# EAGLE design 2KbeaconDetectorV1.0 (EAGLE 9.6.2)
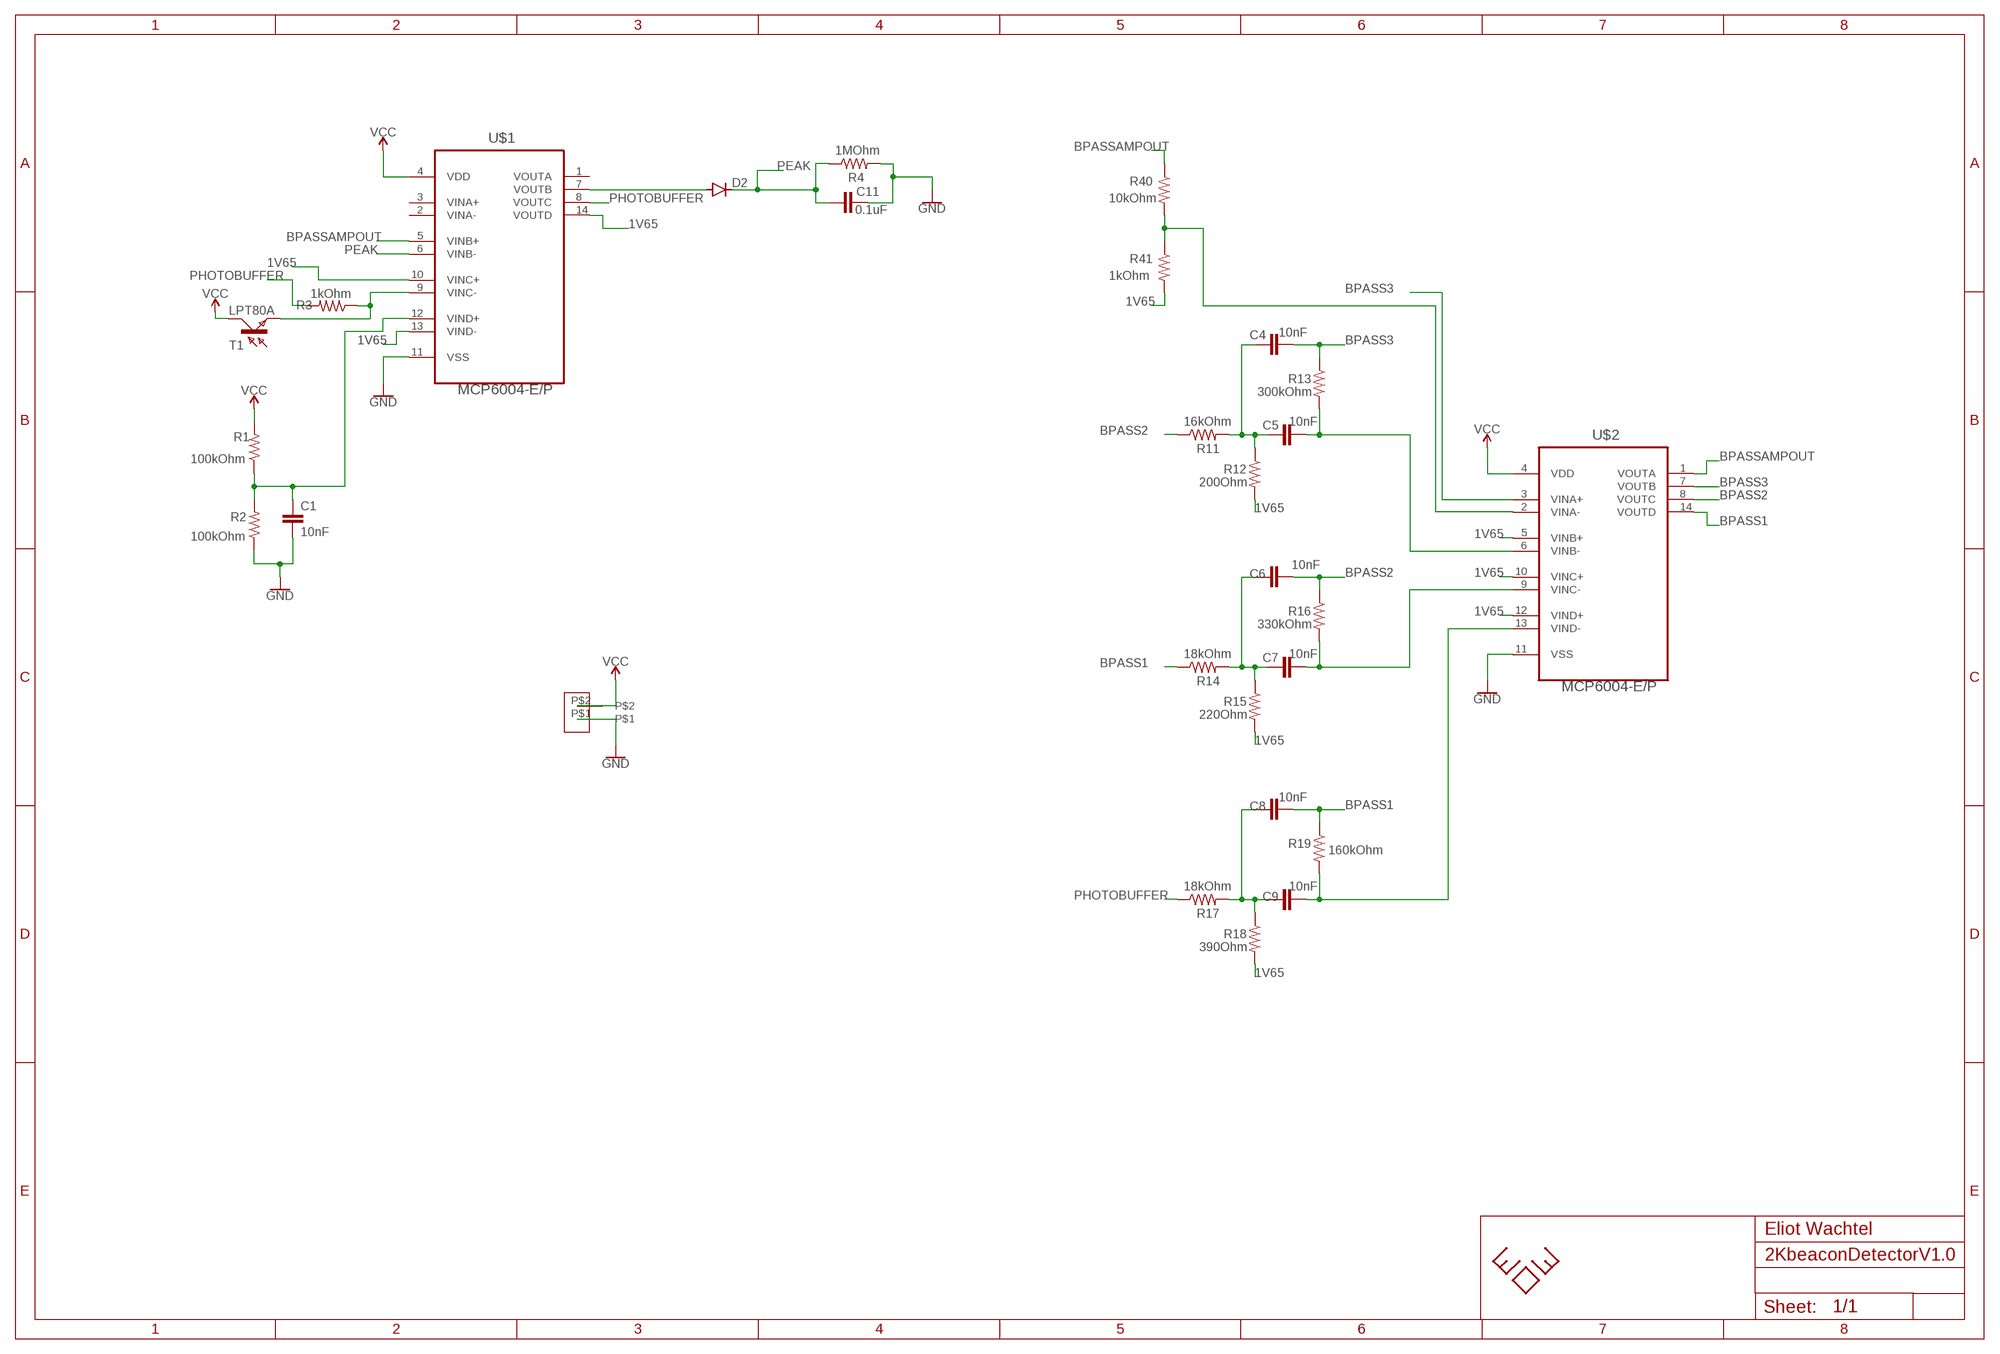
[diagram p0: schematic, sheet 1]

## Parts
C1  10nF  C5/2.5  [C5B2.5]
C4  10nF  C5/2.5  [C5B2.5]
C5  10nF  C5/2.5  [C5B2.5]
C6  10nF  C5/2.5  [C5B2.5]
C7  10nF  C5/2.5  [C5B2.5]
C8  10nF  C5/2.5  [C5B2.5]
C9  10nF  C5/2.5  [C5B2.5]
C11  0.1uF  C5/2.5  [C5B2.5]
D2  DIODE-D-7.5  [D-7.5]
R1  100kOhm  R-US_0207/5V  [0207/5V]
R2  100kOhm  R-US_0207/5V  [0207/5V]
R3  1kOhm  R-US_0204/2V  [0204V]
R4  1MOhm  R-US_0204/5  [0204/5]
R11  16kOhm  R-US_0204/2V  [0204V]
R12  200Ohm  R-US_0204/7  [0204/7]
R13  300kOhm  R-US_0204/2V  [0204V]
R14  18kOhm  R-US_0204/2V  [0204V]
R15  220Ohm  R-US_0204/7  [0204/7]
R16  330kOhm  R-US_0204/2V  [0204V]
R17  18kOhm  R-US_0204/2V  [0204V]
R18  390Ohm  R-US_0204/7  [0204/7]
R19  160kOhm  R-US_0204/2V  [0204V]
R40  10kOhm  R-US_0204/7  [0204/7]
R41  1kOhm  R-US_0204/7  [0204/7]
T1  LPT80A  [LPT80A]
U$1  MCP6004-E/P  [DIP254P762X533-14]
U$2  MCP6004-E/P  [DIP254P762X533-14]
U$4  WIRECONNECT2PIN  [WIRECONNECT2PIN]

## Nets
1V65: R12.2 R15.2 R18.2 R41.2 U$1.10(VINC+) U$1.13(VIND-) U$1.14(VOUTD) U$2.5(VINB+) U$2.10(VINC+) U$2.12(VIND+)
BPASS1: C8.2 R14.1 R19.1 U$2.14(VOUTD)
BPASS2: C6.2 R11.1 R16.1 U$2.8(VOUTC)
BPASS3: C4.2 R13.1 U$2.3(VINA+) U$2.7(VOUTB)
BPASSAMPOUT: R40.1 U$1.5(VINB+) U$2.1(VOUTA)
GND: C1.2 C11.2 R2.1 R4.2 U$1.11(VSS) U$2.11(VSS) U$4.P$1
N$1: C1.1 R1.1 R2.2 U$1.12(VIND+)
N$2: D2.A U$1.7(VOUTB)
N$5: R3.1 T1.E U$1.9(VINC-)
N$8: C4.1 C5.1 R11.2 R12.1
N$9: C7.2 R16.2 U$2.9(VINC-)
N$10: C6.1 C7.1 R14.2 R15.1
N$11: C9.2 R19.2 U$2.13(VIND-)
N$12: C8.1 C9.1 R17.2 R18.1
N$13: C5.2 R13.2 U$2.6(VINB-)
N$25: R40.2 R41.1 U$2.2(VINA-)
PEAK: C11.1 D2.C R4.1 U$1.6(VINB-)
PHOTOBUFFER: R3.2 R17.1 U$1.8(VOUTC)
VCC: R1.2 T1.C U$1.4(VDD) U$2.4(VDD) U$4.P$2
Unconnected: U$1.1(VOUTA) U$1.2(VINA-) U$1.3(VINA+)

## Notes on the sheet
- Eliot Wachtel

## Library data of the parts
C1 C4-C9 C11 = capacitor-wima:C: CAPACITOR naming: grid - package width
D2 = diode:DIODE-: DIODE
R1-R4 R11-R19 R40 R41 = adafruit:R-US_: RESISTOR, American symbol
T1 = opto-trans-siemens:LPT80A: PHOTO TRANSISTOR; OC_FARNELL: unknown; OC_NEWARK: unknown
U$1 U$2 = MCP6004-E_P:MCP6004-E/P: 1 MHz, Low-Power Op Amp; DESCRIPTION: Op Amp Quad Low Power Amplifier R-R I/O 6V Automotive 14-Pin PDIP Tube; DIGI-KEY_PART_NUMBER: MCP6004-E/P-ND; MF: Microchip Technology; MP: MCP6004-E/P; PACKAGE: DIP-14 Microchip; PURCHASE-URL: https://pricing.snapeda.com/search/part/MCP6004-E/P/?ref=eda
U$4 = connectors:WIRECONNECT2PIN

## Board
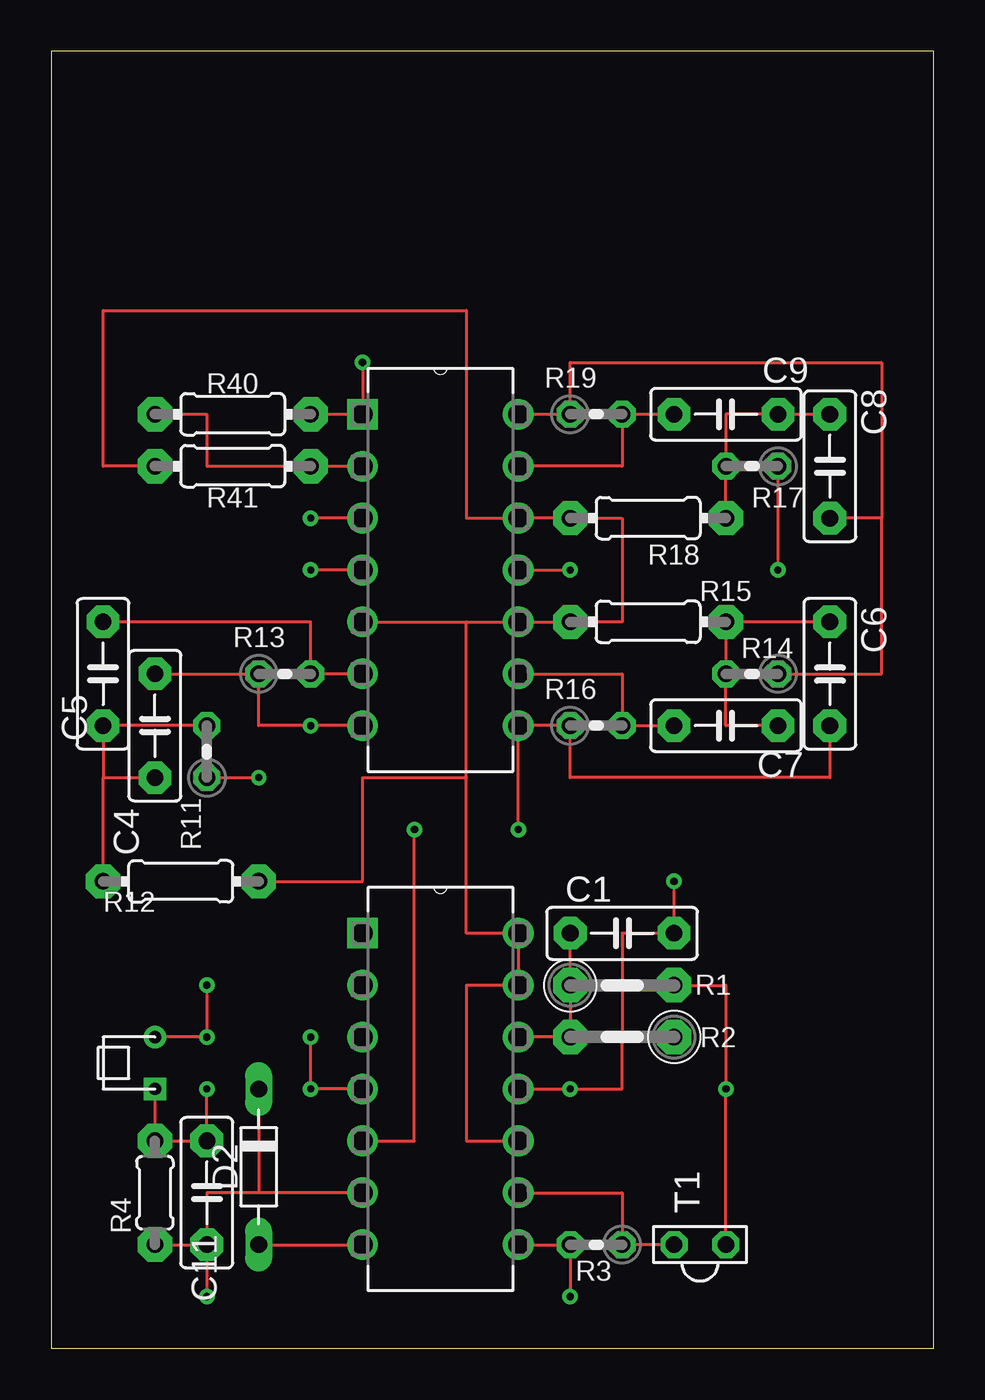
[diagram p1: board, top side]
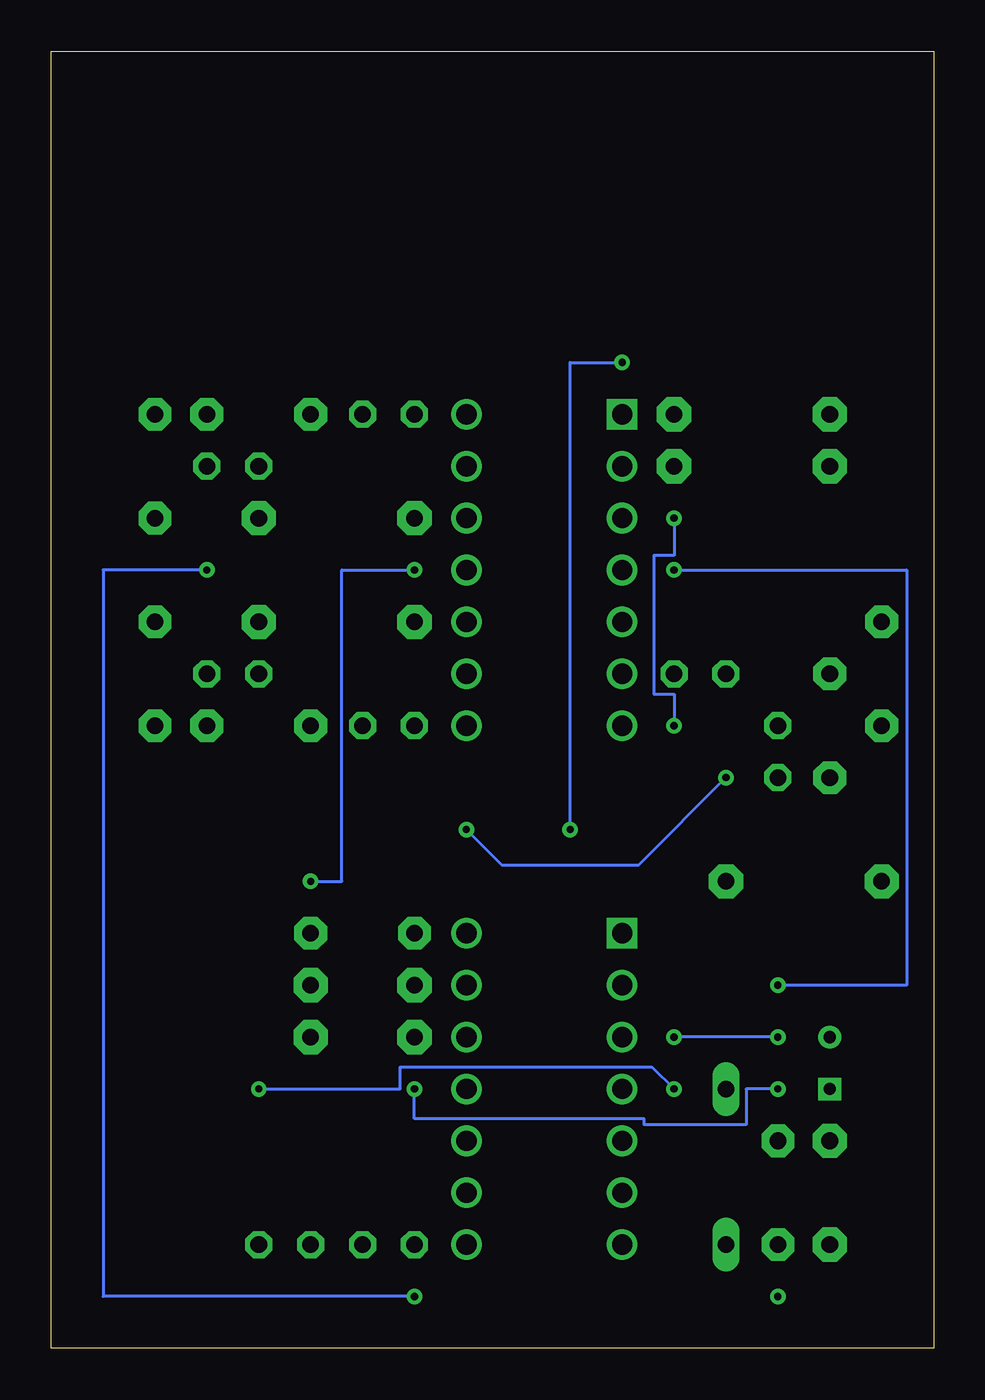
[diagram p2: board, bottom side, seen from below]

Size 43.18 x 63.5 mm. Coordinates in mm from the lower left corner, seen from the top.
Outline: 0,0 43.18,0 43.18,63.5 0,63.5 0,0
Copper layers (1*16): Top 0.035mm / dielectric 1.5mm / Bottom 0.035mm
Design rules "default": minimum track width 6mil, minimum drill 0.35mm, track to track 6mil, track to pad 6mil, pad to pad 6mil, via to via 6mil, smd to smd 6mil, copper to edge 40mil, drill to drill 6mil, minimum pad ring 10mil, minimum via ring 8mil, stop-mask expansion 4mil, vias tented up to drill 0mil, thermal gap 10mil

### Footprints (pad centres in the part's own frame; a part is rotated, then mirrored left to right if it is on the bottom)
C5B2.5 = drill 0.813 pad 1.6 octagon: 1 -2.54,0; 2 2.54,0
D-7.5 = drill 0.813 long: A 3.81,0; C -3.81,0
0207/5V = drill 0.813 pad 1.676 octagon: 1 -2.54,0; 2 2.54,0
0204V = drill 0.813 octagon: 1 -1.27,0; 2 1.27,0
0204/5 = drill 0.813 pad 1.676 octagon: 1 -2.54,0; 2 2.54,0
0204/7 = drill 0.813 pad 1.676 octagon: 1 -3.81,0; 2 3.81,0
LPT80A = drill 0.813 octagon: C 0,-1.27; E 0,1.27
DIP254P762X533-14 = drill 0.991 square: 1 -7.62,15.24 | drill 0.991: 2 -7.62,12.7; 3 -7.62,10.16; 4 -7.62,7.62; 5 -7.62,5.08; 6 -7.62,2.54; 7 -7.62,0; 8 0,0; 9 0,2.54; 10 0,5.08; 11 0,7.62; 12 0,10.16; 13 0,12.7; 14 0,15.24
WIRECONNECT2PIN = drill 0.6 square: P$1 2.54,0 | drill 0.6: P$2 2.54,2.54

### Placement (x,y rotation side)
C1  27.94,20.32 0 top
C4  5.08,30.48 90 top
C5  2.54,33.02 90 top
C6  38.1,33.02 270 top
C7  33.02,30.48 180 top
C8  38.1,43.18 270 top
C9  33.02,45.72 180 top
C11  7.62,7.62 90 top
D2  10.16,8.89 270 top
R1  27.94,17.78 0 top
R2  27.94,15.24 180 top
R3  26.67,5.08 180 top
R4  5.08,7.62 90 top
R11  7.62,29.21 90 top
R12  6.35,22.86 0 top
R13  11.43,33.02 0 top
R14  34.29,33.02 180 top
R15  29.21,35.56 180 top
R16  26.67,30.48 0 top
R17  34.29,43.18 180 top
R18  29.21,40.64 180 top
R19  26.67,45.72 0 top
R40  8.89,45.72 180 top
R41  8.89,43.18 180 top
T1  31.75,5.08 90 top
U$1  22.86,5.08 0 top
U$2  22.86,30.48 0 top
U$4  2.54,12.7 0 top

### Tracks (layer width: path | path; a pad name or v marks a point on that pad's centre or on a via)
1V65
  Top 0.152: U$2.5 20.32,35.56 | 20.32,35.56 U$2.10 R15.2 27.94,35.56 27.94,40.64 R18.2 U$2.12 20.32,40.64 20.32,50.8 2.54,50.8 2.54,43.18 R41.2 | U$1.10 20.32,10.16 20.32,17.78 U$1.13 U$1.14 20.32,20.32 20.32,27.94 | 20.32,27.94 20.32,35.56 | R12.2 15.24,22.86 15.24,27.94 20.32,27.94
BPASS1
  Top 0.152: U$2.14 R19.1 25.4,48.26 40.64,48.26 40.64,40.64 | R14.1 40.64,33.02 40.64,40.64 | 40.64,40.64 C8.2
BPASS2  (via drill 0.35)
  Top 0.152: C6.2 38.1,27.94 25.4,27.94 R16.1 U$2.8 v22.86,25.4 | R11.1 v10.16,27.94
  Bottom 0.152: v10.16,27.94 14.42,23.68 21.14,23.68 v22.86,25.4
BPASS3  (via drill 0.35)
  Top 0.152: U$2.7 v12.7,30.48 10.16,30.48 R13.1 C4.2 | U$2.3 v12.7,40.64
  Bottom 0.152: v12.7,40.64 12.7,38.81 13.69,38.81 13.69,32.03 12.7,32.03 v12.7,30.48
BPASSAMPOUT  (via drill 0.35)
  Top 0.152: U$1.5 17.78,10.16 v17.78,25.4 | v15.24,48.26 U$2.1 R40.1
  Bottom 0.152: v17.78,25.4 17.78,48.26 v15.24,48.26
GND  (via drill 0.35)
  Top 0.152: U$4.P$1 R4.2 C11.2 v7.62,12.7 | 27.94,15.24 27.94,20.32 C1.2 v30.48,22.86 | 27.94,15.24 R2.1 | U$1.11 v25.4,12.7 27.94,12.7 27.94,15.24 | U$2.11 v25.4,38.1
  Bottom 0.152: v7.62,12.7 9.17,12.7 9.17,10.95 14.16,10.95 14.16,11.24 25.4,11.24 v25.4,12.7 | v25.4,38.1 28.96,38.1 28.96,22.86 v30.48,22.86
N$1
  Top 0.152: U$1.12 R2.2 R1.1 C1.1
N$2
  Top 0.152: D2.A U$1.7
N$5
  Top 0.152: T1.E R3.1 27.94,7.62 U$1.9
N$8
  Top 0.152: 2.54,27.94 C5.1 R11.2 | 2.54,27.94 C4.1 | R12.1 2.54,27.94
N$9
  Top 0.152: U$2.9 27.94,33.02 R16.2 C7.2
N$10
  Top 0.152: C7.1 33.02,30.48 R14.2 R15.1 C6.1
N$11
  Top 0.152: U$2.13 27.94,43.18 R19.2 C9.2
N$12
  Top 0.152: R18.1 R17.2 33.02,45.72 C9.1 C8.1
N$13
  Top 0.152: U$2.6 R13.2 12.7,35.56 C5.2
N$25
  Top 0.152: U$2.2 R41.1 7.62,43.18 7.62,45.72 R40.2
PEAK  (via drill 0.35)
  Top 0.152: R4.1 C11.1 | D2.C 10.16,7.62 | 10.16,7.62 7.62,7.62 C11.1 | U$1.6 10.16,7.62 | C11.1 v7.62,2.54
PHOTOBUFFER  (via drill 0.35)
  Top 0.152: U$1.8 R3.2 v25.4,2.54 | R17.1 v35.56,38.1
  Bottom 0.152: v25.4,2.54 40.64,2.54 40.64,38.1 v35.56,38.1
VCC  (via drill 0.35)
  Top 0.152: R1.2 33.02,17.78 v33.02,12.7 T1.C | U$1.4 v12.7,12.7 v12.7,15.24 | U$4.P$2 v7.62,15.24 v7.62,17.78 | U$2.4 v12.7,38.1
  Bottom 0.152: v7.62,15.24 v12.7,15.24 | v12.7,38.1 1.32,38.1 1.32,17.78 v7.62,17.78 | v12.7,12.7 13.78,13.78 26.11,13.78 26.11,12.7 v33.02,12.7